# EAGLE design led (EAGLE 7.1.0)
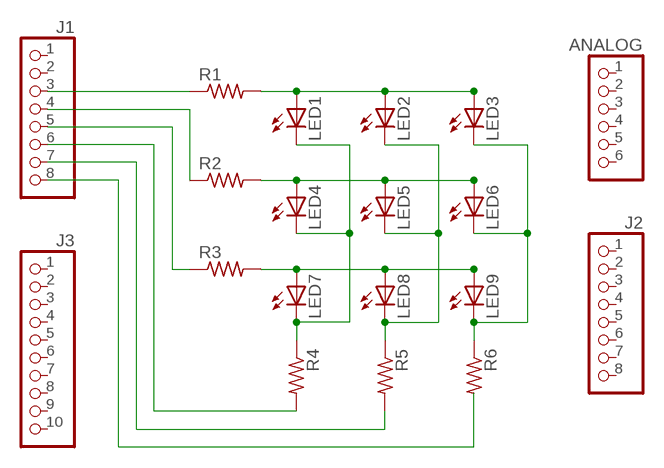
[diagram p0: schematic, sheet 1]

## Parts
ANALOG  PINHD-1X6  [1X06]
J1  PINHD-1X8TH  [1X08-TH]
J2  PINHD-1X8TH  [1X08-TH]
J3  PINHD-1X10TH  [1X10-TH]
LED1  LED3MM  [LED3MM]
LED2  LED3MM  [LED3MM]
LED3  LED3MM  [LED3MM]
LED4  LED3MM  [LED3MM]
LED5  LED3MM  [LED3MM]
LED6  LED3MM  [LED3MM]
LED7  LED3MM  [LED3MM]
LED8  LED3MM  [LED3MM]
LED9  LED3MM  [LED3MM]
R1  R-US_0207/10  [0207/10]
R2  R-US_0207/10  [0207/10]
R3  R-US_0207/10  [0207/10]
R4  R-US_0207/10  [0207/10]
R5  R-US_0207/10  [0207/10]
R6  R-US_0207/10  [0207/10]

## Nets
N$1: LED1.A LED2.A LED3.A R1.2
N$2: J1.3 R1.1
N$3: LED4.A LED5.A LED6.A R2.2
N$4: LED7.A LED8.A LED9.A R3.2
N$6: LED3.K(C) LED6.K(C) LED9.K(C) R6.1
N$7: LED2.K(C) LED5.K(C) LED8.K(C) R5.1
N$8: J1.5 R3.1
N$9: J1.4 R2.1
N$13: LED1.K(C) LED4.K(C) LED7.K(C) R4.1
N$14: J1.6 R4.2
N$15: J1.7 R5.2
N$18: J1.8 R6.2
Unconnected: ANALOG.1 ANALOG.2 ANALOG.3 ANALOG.4 ANALOG.5 ANALOG.6 J1.1 J1.2 J2.1 J2.2 J2.3 J2.4 J2.5 J2.6 J2.7 J2.8 J3.1 J3.2 J3.3 J3.4 J3.5 J3.6 J3.7 J3.8 J3.9 J3.10

## Library data of the parts
ANALOG = pinhead:PINHD-1X6: PIN HEADER
J1 J2 = SmartPrj:PINHD-1X8: PIN HEADER
J3 = SmartPrj:PINHD-1X10: PIN HEADER
LED1-LED9 = led:LED: LED OSRAM: - CHIPLED LG R971, LG N971, LY N971, LG Q971, LY Q971, LO R971, LY R971 LH N974, LH R974 LS Q976, LO Q976, LY Q976 LO Q996 - Hyper CHIPLED LW Q18S LB Q993, LB Q99A, LB R99A - SideLED LS A670, LO A670, LY A670, LG A670, LP A670 LB A673, LV A673, LT A673, LW A673 LH A674 LY A675 LS A676, LA A676, LO A676, LY A676, LW A676 LS A679, LY A679, LG A679 - Hyper Micro SIDELED® LS Y876, LA Y876, LO Y876, LY Y876 LT Y87S - SmartLED LW L88C, LW L88S LB L89C, LB L89S, LG L890 LS L89K, LO L89K, LY L89K LS L896, LA L896, LO L896, LY L896 - TOPLED LS T670, LO T670, LY T670, LG T670, LP T670 LSG T670, LSP T670, LSY T670, LOP T670, LYG T670 LG T671, LOG T671, LSG T671 LB T673, LV T673, LT T673, LW T673 LH T674 LS T676, LA T676, LO T676, LY T676, LB T676, LH T676, LSB T676, LW T676 LB T67C, LV T67C, LT T67C, LS T67K, LO T67K, LY T67K, LW E67C LS E67B, LA E67B, LO E67B, LY E67B, LB E67C, LV E67C, LT E67C LW T67C LS T679, LY T679, LG T679 LS T770, LO T770, LY T770, LG T770, LP T770 LB T773, LV T773, LT T773, LW T773 LH T774 LS E675, LA E675, LY E675, LS T675 LS T776, LA T776, LO T776, LY T776, LB T776 LHGB T686 LT T68C, LB T68C - Hyper Mini TOPLED® LB M676 - Mini TOPLED Santana® LG M470 LS M47K, LO M47K, LY M47K Source: http://www.osram.convergy.de LUXEON: - LUMILED® LXK2-PW12-R00, LXK2-PW12-S00, LXK2-PW14-U00, LXK2-PW14-V00 LXK2-PM12-R00, LXK2-PM12-S00, LXK2-PM14-U00 LXK2-PE12-Q00, LXK2-PE12-R00, LXK2-PE12-S00, LXK2-PE14-T00, LXK2-PE14-U00 LXK2-PB12-K00, LXK2-PB12-L00, LXK2-PB12-M00, LXK2-PB14-N00, LXK2-PB14-P00, LXK2-PB14-Q00 LXK2-PR12-L00, LXK2-PR12-M00, LXK2-PR14-Q00, LXK2-PR14-R00 LXK2-PD12-Q00, LXK2-PD12-R00, LXK2-PD12-S00 LXK2-PH12-R00, LXK2-PH12-S00 LXK2-PL12-P00, LXK2-PL12-Q00, LXK2-PL12-R00 Source: www.luxeon.com KINGBRIGHT: KA-3528ASYC Source: www.kingbright.com
R1-R6 = resistor:R-US_: RESISTOR, American symbol

## Board
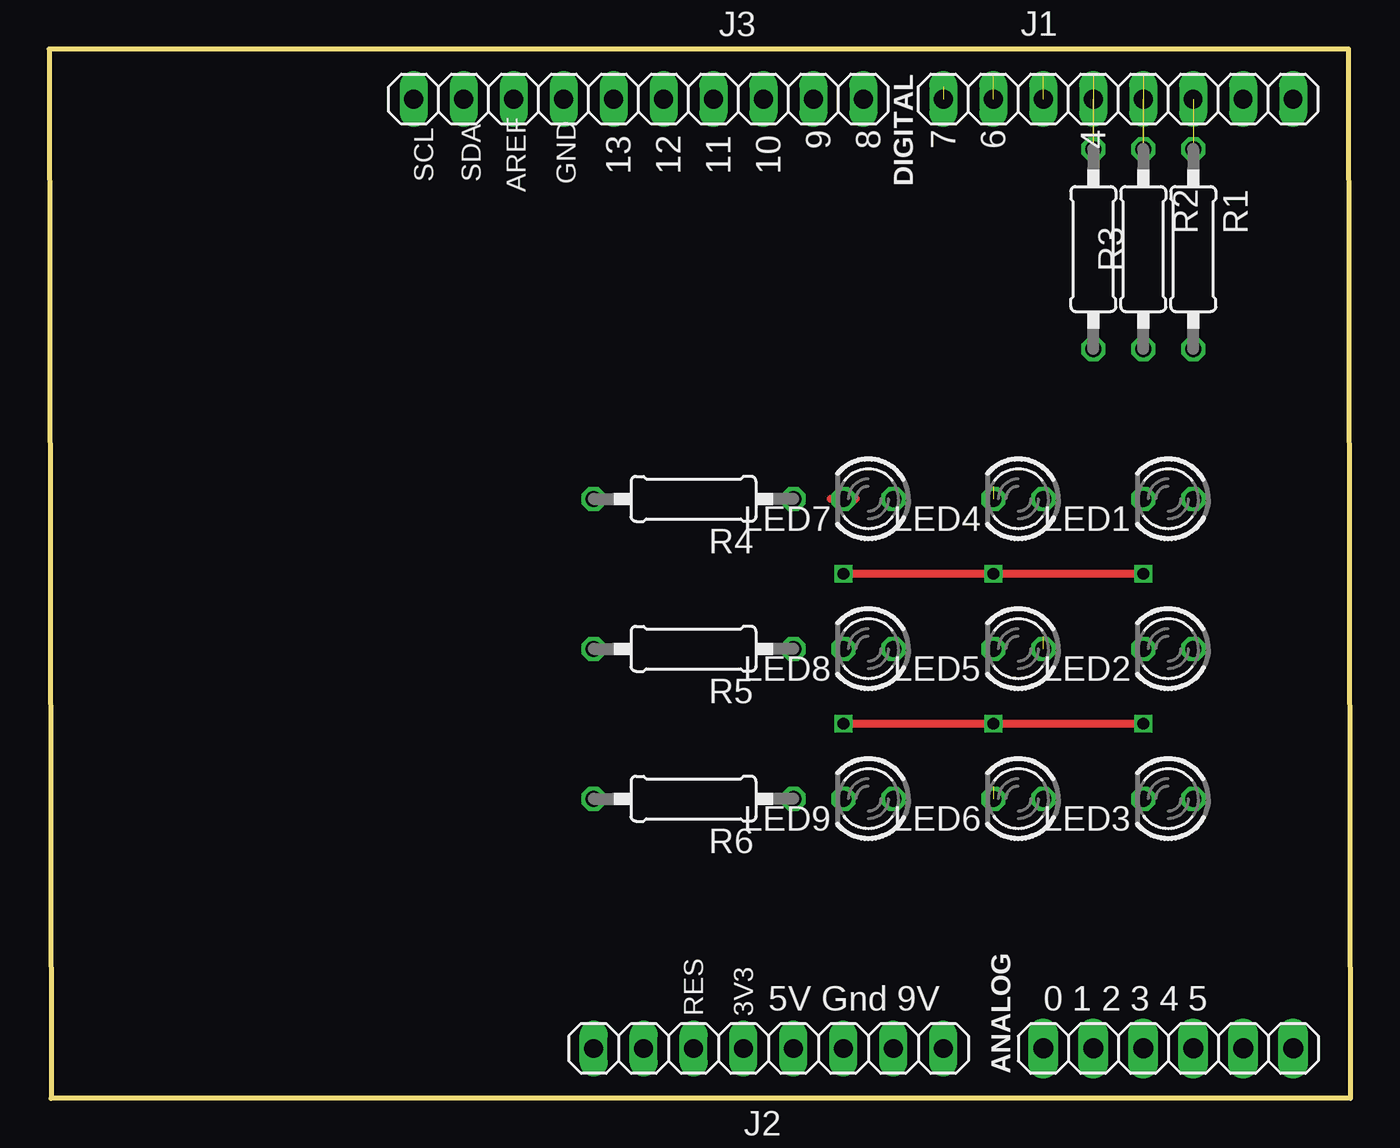
[diagram p1: board, top side]
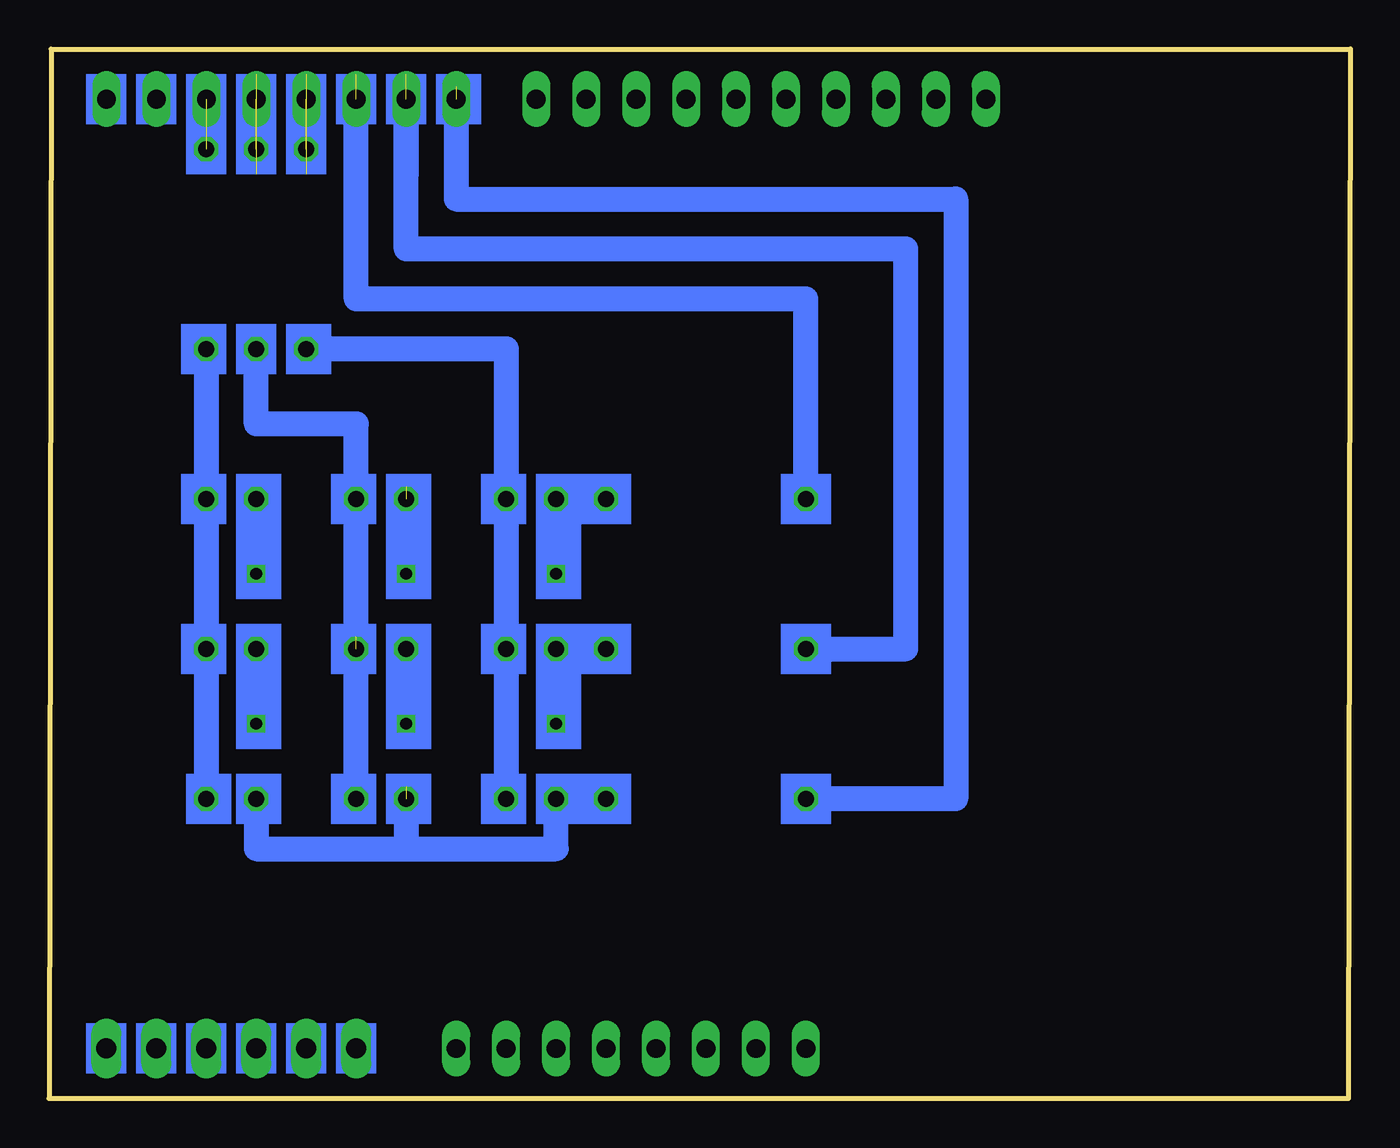
[diagram p2: board, bottom side, seen from below]

Size 66.14 x 53.34 mm. Coordinates in mm from the lower left corner, seen from the top.
Outline: 66.14,0 0.09,0 0,53.34 66.04,53.34 66.14,0
Copper layers (1*16): Top 0.035mm / dielectric 1.53mm / Bottom 0.035mm
Design rules "pban_4mil-l2": minimum track width 0.1mm, minimum drill 0.3mm, track to track 0.1mm, track to pad 0.229mm, pad to pad 0.1mm, via to via 0.1mm, smd to smd 0.1mm, copper to edge 0.5mm, drill to drill 0.5mm, minimum pad ring 0.15mm, minimum via ring 0.15mm, stop-mask expansion 4mil, vias tented up to drill 0.35mm, thermal gap 10mil

### Footprints (pad centres in the part's own frame; a part is rotated, then mirrored left to right if it is on the bottom)
1X06 = drill 1.016 long: 1 -6.35,0; 2 -3.81,0; 3 -1.27,0; 4 1.27,0; 5 3.81,0; 6 6.35,0
1X08-TH = drill 0.95 pad 1.422 long: 1 -8.89,0; 2 -6.35,0; 3 -3.81,0; 4 -1.27,0; 5 1.27,0; 6 3.81,0; 7 6.35,0; 8 8.89,0
1X10-TH = drill 0.95 pad 1.422 long: 1 -11.43,0; 2 -8.89,0; 3 -6.35,0; 4 -3.81,0; 5 -1.27,0; 6 1.27,0; 7 3.81,0; 8 6.35,0; 9 8.89,0; 10 11.43,0
LED3MM = drill 0.813 octagon: A -1.27,0; K 1.27,0
0207/10 = drill 0.813 octagon: 1 -5.08,0; 2 5.08,0

### Placement (x,y rotation side)
ANALOG  56.88,2.54 0 top
J1  54.34,50.8 180 top
J2  36.56,2.54 0 top
J3  29.96,50.8 180 top
LED1  56.88,30.48 180 top
LED2  56.88,22.86 180 top
LED3  56.88,15.24 180 top
LED4  49.26,30.48 180 top
LED5  49.26,22.86 180 top
LED6  49.26,15.24 180 top
LED7  41.64,30.48 180 top
LED8  41.64,22.86 180 top
LED9  41.64,15.24 180 top
R1  58.15,43.18 270 top
R2  55.61,43.18 270 top
R3  53.07,43.18 270 top
R4  32.75,30.48 180 top
R5  32.75,22.86 180 top
R6  32.75,15.24 180 top

### Tracks (layer width: path | path; a pad name or v marks a point on that pad's centre or on a via)
N$1
  Bottom 1.27: R1.2 LED1.A LED2.A LED3.A
N$2  (1 unrouted)
  Bottom 1.27: J1.3 R1.1
N$3  (1 unrouted)
  Bottom 1.27: LED6.A LED5.A | R2.2 55.61,34.29 50.53,34.29 LED4.A 50.53,23.5
N$4
  Bottom 1.27: R3.2 42.91,38.1 LED7.A LED8.A 42.91,15.88 | 43.54,15.88 42.91,15.88 | 42.91,15.88 LED9.A
N$6  (1 unrouted)
  Bottom 1.27: LED3.K 55.61,12.7 47.99,12.7 | 47.99,15.88 47.99,12.7 | 47.99,12.7 40.37,12.7 LED9.K R6.1
N$7  (via drill 0.6)
  Top 0.406: v55.61,19.05 v47.99,19.05 v40.37,19.05
  Bottom 1.27: LED2.K v55.61,19.05 | LED5.K v47.99,19.05 | v40.37,19.05 LED8.K R5.1 37.2,23.5
N$8  (1 unrouted)
  Bottom 1.27: J1.5 53.07,48.9 R3.1
N$9  (1 unrouted)
  Bottom 1.27: J1.4 R2.1
N$10  (1 unrouted)
N$11  (2 unrouted)
N$13  (via drill 0.6)  (1 unrouted)
  Top 0.406: v55.61,26.67 v47.99,26.67 v40.37,26.67 | 39.73,30.48 LED7.K 41,30.48
  Bottom 1.27: LED1.K v55.61,26.67 | v47.99,26.67 47.99,31.11 | v40.37,26.67 LED7.K R4.1
N$14  (1 unrouted)
  Bottom 1.27: R4.2 27.67,40.64 50.53,40.64 J1.6
N$15  (1 unrouted)
  Bottom 1.27: 47.99,46.99 J1.7 47.99,43.18 22.59,43.18 22.59,22.86 R5.2
N$18  (1 unrouted)
  Bottom 1.27: 45.45,51.44 45.45,45.72 20.05,45.72 20.05,15.24 R6.2
(copper drawn outside any net)
  shapes: Bottom area x41

### Text on the board
tPlace: 9 | 8 | 7 | 6 | 4 | 13 | 12 | 11 | 10
tNames: DIGITAL | AREF | SCL | SDA | GND | RES | 3V3 | 5V Gnd 9V | 0 1 2 3 4 5
bStop: DIGITAL | SDA | AREF | SCL | GND | 13 | 12 | 11 | 10 | 9 | 8 | 7 | 6 | 4 | 3 | 2 | 1 | 0 | IOREF | RST | 3.3V | 5V | GND | GND | VIN | 0 | 1 | 2 | 3 | 4 | 5 | 5